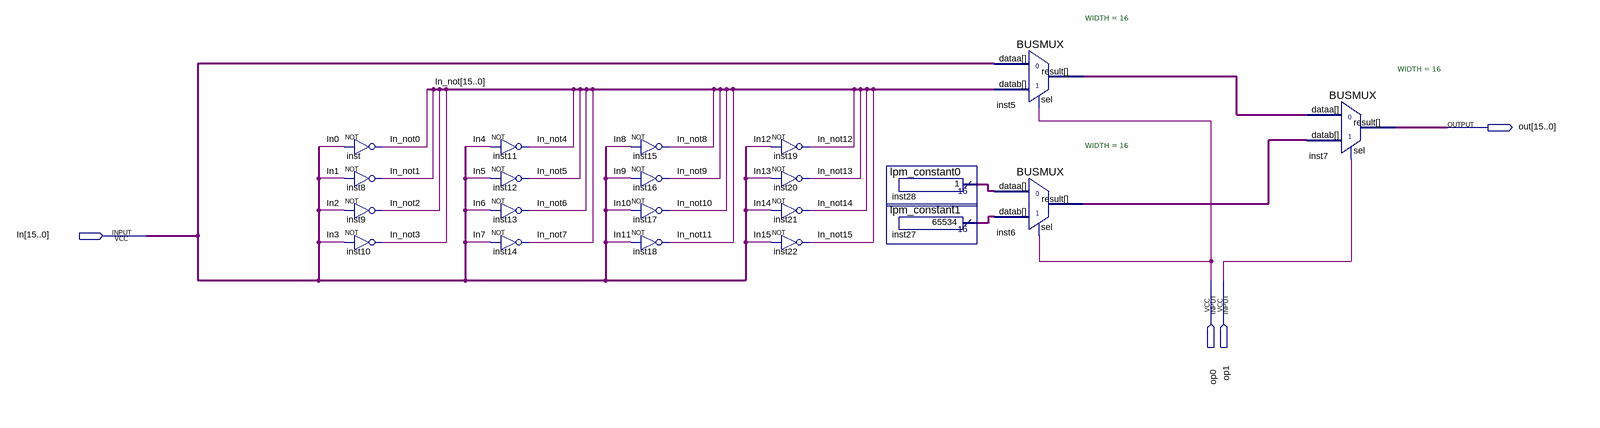
[diagram p0: schematic sheet]
// Quartus schematic mux_au.bdf as structural Verilog: 21 symbols, 4 pins
module mux_au (
  input  [15:0] In,
  input  op0,
  input  op1,
  output [15:0] out
);

  wire [15:0] In_not, inst5_result, inst6_result, inst27_result, inst28_result;

  not inst (In_not[0], In[0]);
  not inst8 (In_not[1], In[1]);
  not inst9 (In_not[2], In[2]);
  not inst10 (In_not[3], In[3]);
  not inst11 (In_not[4], In[4]);
  not inst12 (In_not[5], In[5]);
  not inst13 (In_not[6], In[6]);
  not inst14 (In_not[7], In[7]);
  not inst15 (In_not[8], In[8]);
  not inst16 (In_not[9], In[9]);
  not inst17 (In_not[10], In[10]);
  not inst18 (In_not[11], In[11]);
  not inst19 (In_not[12], In[12]);
  not inst20 (In_not[13], In[13]);
  not inst21 (In_not[14], In[14]);
  not inst22 (In_not[15], In[15]);
  lpm_constant0 inst28 (.result(inst28_result));
  lpm_constant1 inst27 (.result(inst27_result));
  BUSMUX #(.WIDTH(16)) inst5 (.datab(In_not), .sel(op0), .dataa(In), .result(inst5_result));
  BUSMUX #(.WIDTH(16)) inst6 (.datab(inst27_result), .sel(op0), .dataa(inst28_result), .result(inst6_result));
  BUSMUX #(.WIDTH(16)) inst7 (.datab(inst6_result), .sel(op1), .dataa(inst5_result), .result(out));
endmodule
